# EAGLE schematic cft-int-board-smd (EAGLE 5.11)
DRAWN_BY: Alexios; PROJECT_NAME: CFT Mini-Computer; REVISION: Rev J; SHEET_DESCRIPTION: Bus Connectors; SIMULATION_FILENAME: N/A; URL: http://www.bedroomlan.org/cft

## Sheet 1 of 3
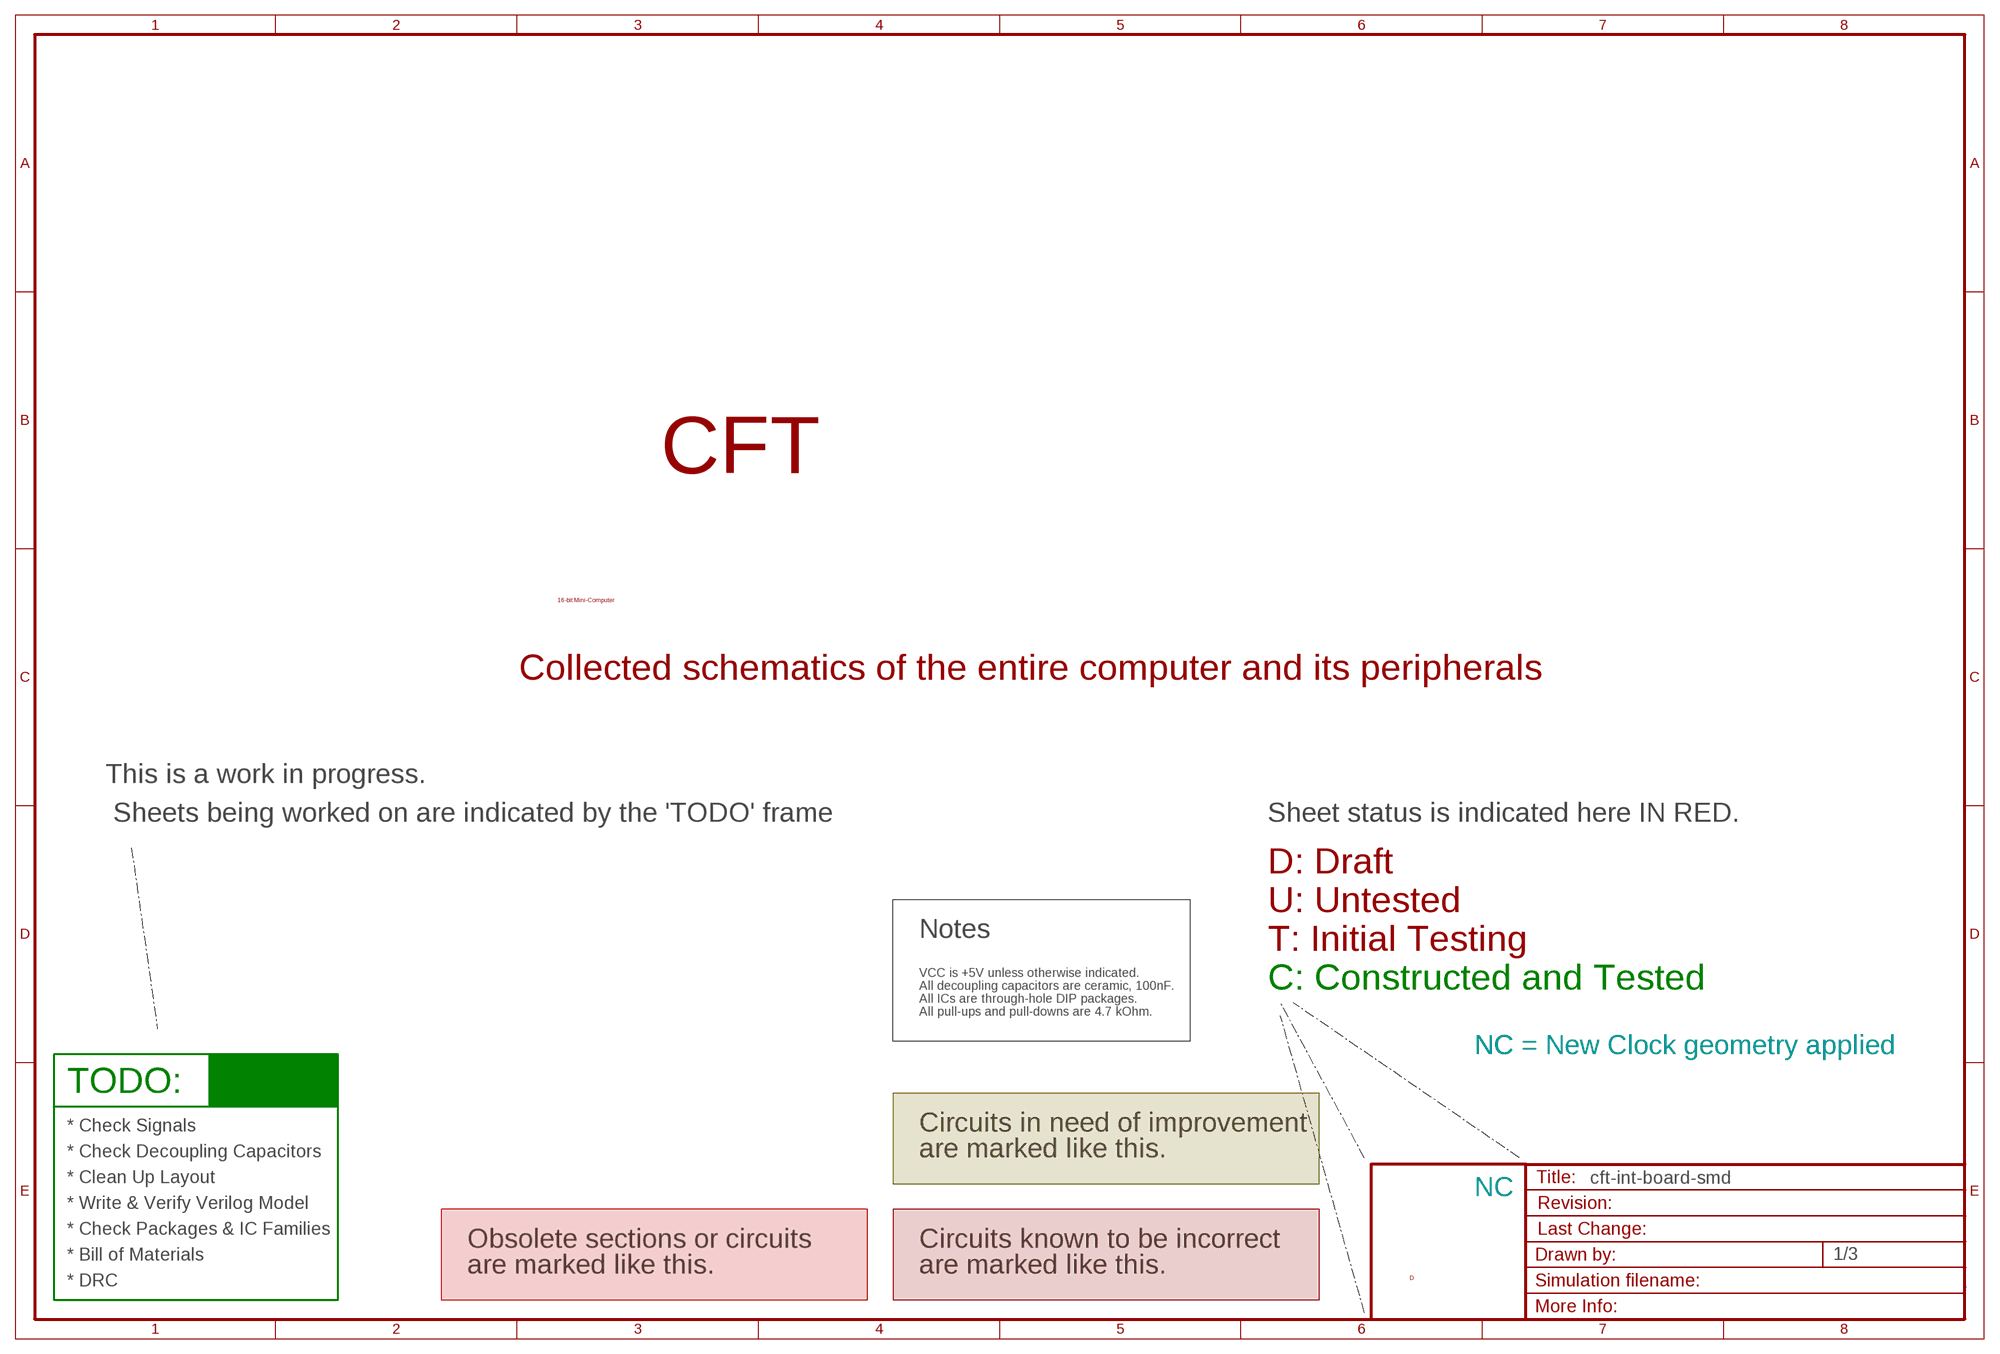
[diagram p0: schematic, sheet 1]

### Notes on the sheet
- CFT
- 16-bit Mini-Computer
- Collected schematics of the entire computer and its peripherals
- This is a work in progress.
- Sheets being worked on are indicated by the 'TODO' frame | Sheet status is indicated here IN RED.
- D: Draft
- U: Untested
- Notes
- T: Initial Testing
- VCC is +5V unless otherwise indicated.
- All decoupling capacitors are ceramic, 100nF. | C: Constructed and Tested
- All ICs are through-hole DIP packages.
- All pull-ups and pull-downs are 4.7 kOhm.
- NC | NC = New Clock geometry applied
- TODO:
- * Check Signals | Circuits in need of improvement
- * Check Decoupling Capacitors | are marked like this.
- * Clean Up Layout
- NC
- * Write & Verify Verilog Model
- * Check Packages & IC Families
- Obsolete sections or circuits | Circuits known to be incorrect
- * Bill of Materials
- are marked like this. | are marked like this.
- D
- * DRC

## Sheet 2 of 3
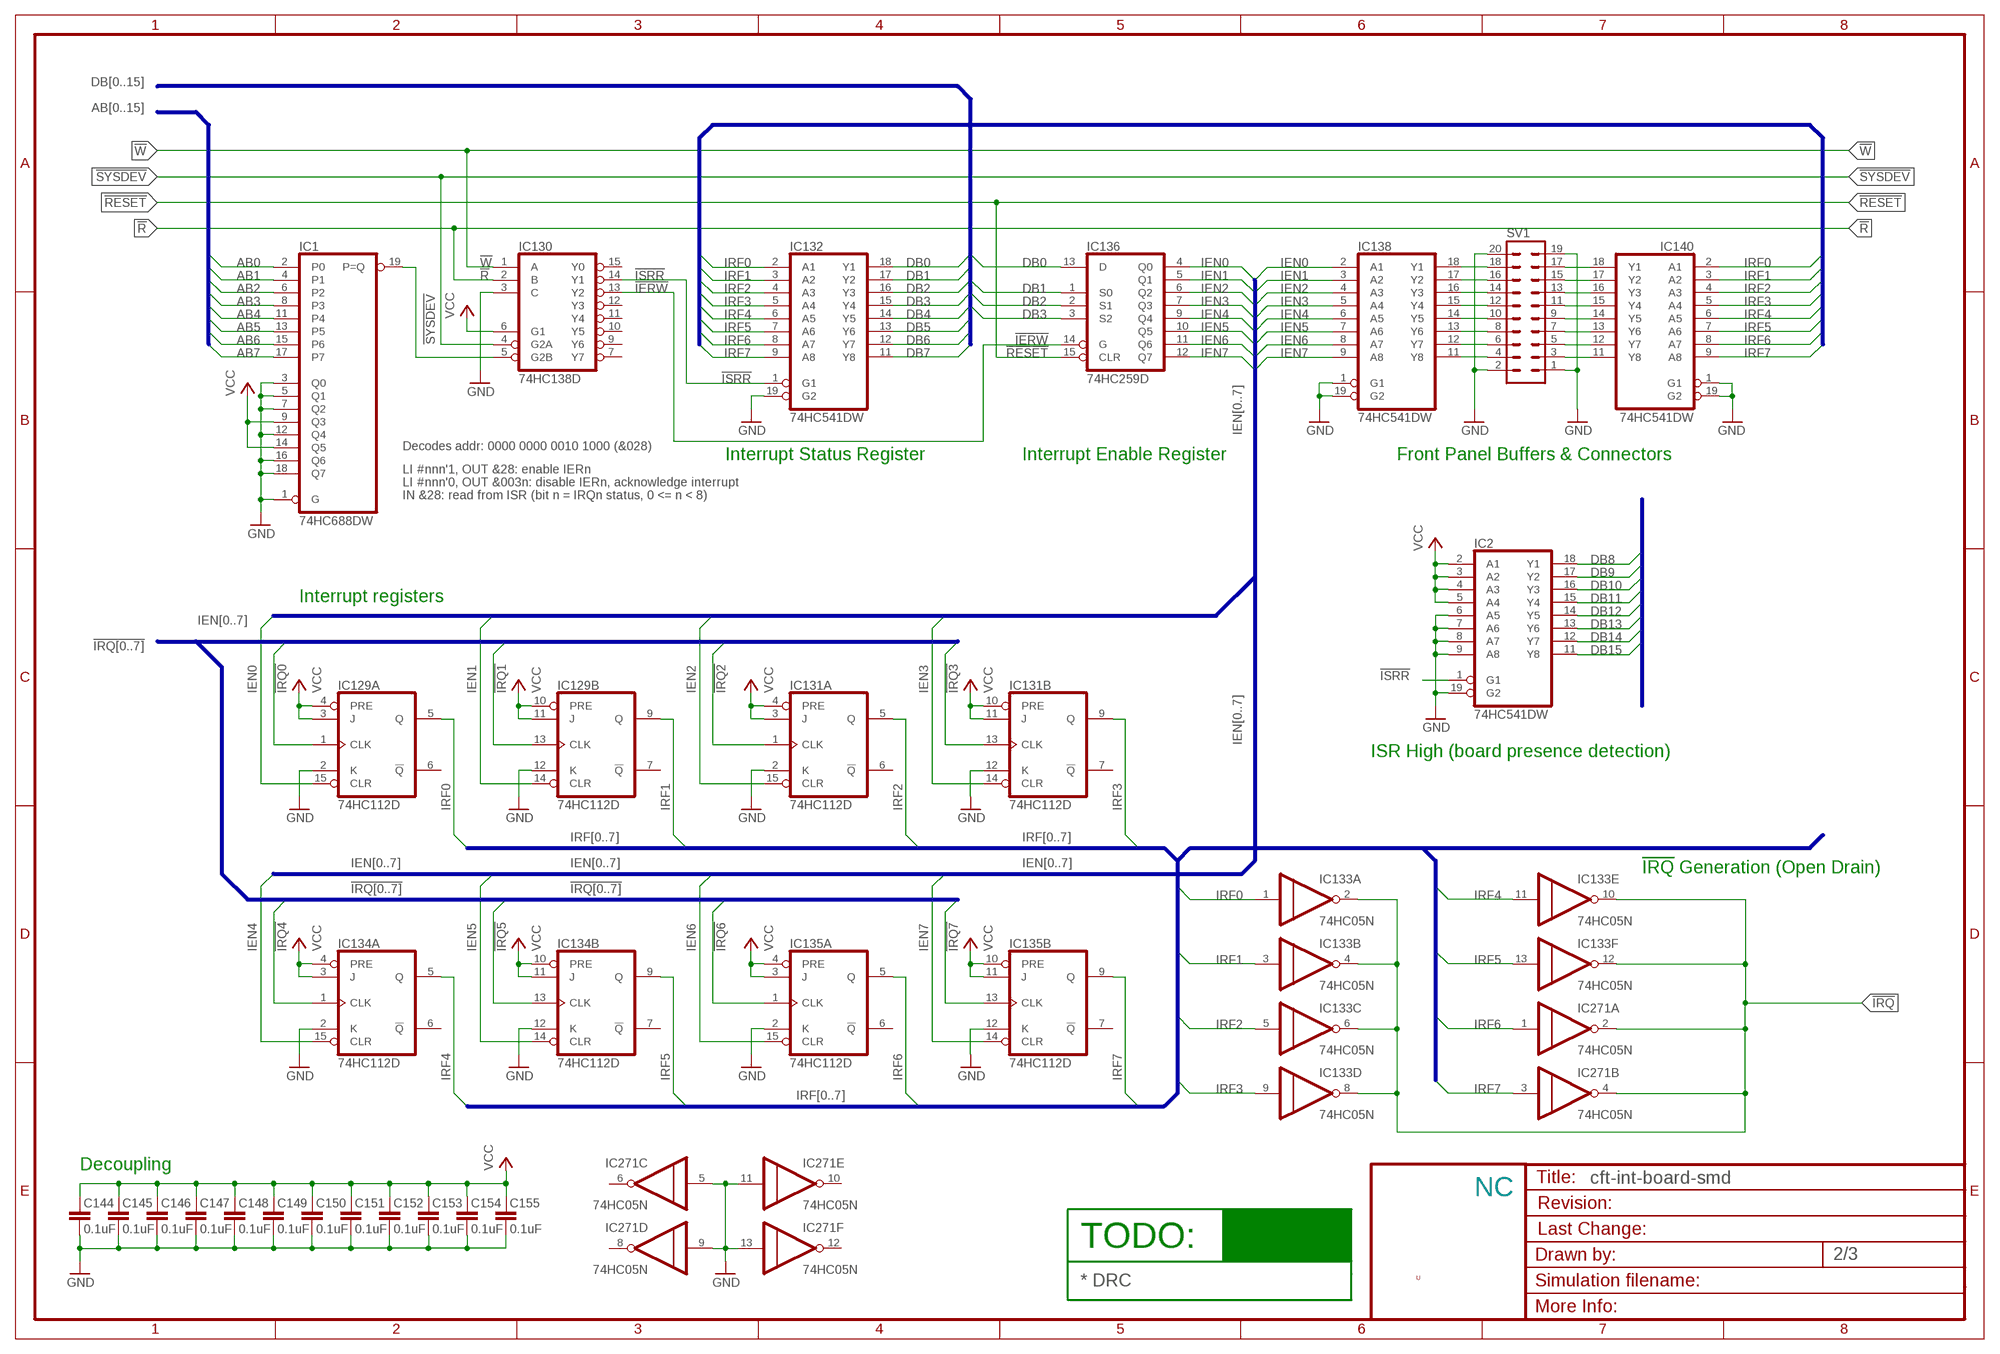
[diagram p1: schematic, sheet 2]

### Parts
C144  0.1uF  C-EU025-024X044  [C025-024X044]
C145  0.1uF  C-EU025-024X044  [C025-024X044]
C146  0.1uF  C-EU025-024X044  [C025-024X044]
C147  0.1uF  C-EU025-024X044  [C025-024X044]
C148  0.1uF  C-EU025-024X044  [C025-024X044]
C149  0.1uF  C-EU025-024X044  [C025-024X044]
C150  0.1uF  C-EU025-024X044  [C025-024X044]
C151  0.1uF  C-EU025-024X044  [C025-024X044]
C152  0.1uF  C-EU025-024X044  [C025-024X044]
C153  0.1uF  C-EU025-024X044  [C025-024X044]
C154  0.1uF  C-EU025-024X044  [C025-024X044]
C155  0.1uF  C-EU025-024X044  [C025-024X044]
IC1  74HC688DW  [SO20W]
IC2  74HC541DW  [SO20W]
IC129  74HC112D  [SO16]
IC130  74HC138D  [SO16]
IC131  74HC112D  [SO16]
IC132  74HC541DW  [SO20W]
IC133  74HC05N  [DIL14]
IC134  74HC112D  [SO16]
IC135  74HC112D  [SO16]
IC136  74HC259D  [SO16]
IC138  74HC541DW  [SO20W]
IC140  74HC541DW  [SO20W]
IC271  74HC05N  [DIL14]
SV1  ML20L  [ML20L]

### Nets
!IERW: IC130.13(Y2) IC136.14(G)
!IRQ: IC133.2(A:O) IC133.4(B:O) IC133.6(C:O) IC133.8(D:O) IC133.10(E:O) IC133.12(F:O) IC271.2(A:O) IC271.4(B:O) ; also sheet 3
!IRQ0: IC129.1(A:CLK) ; also sheet 3
!IRQ1: IC129.13(B:CLK) ; also sheet 3
!IRQ2: IC131.1(A:CLK) ; also sheet 3
!IRQ3: IC131.13(B:CLK) ; also sheet 3
!IRQ4: IC134.1(A:CLK) ; also sheet 3
!IRQ5: IC134.13(B:CLK) ; also sheet 3
!IRQ6: IC135.1(A:CLK) ; also sheet 3
!IRQ7: IC135.13(B:CLK) ; also sheet 3
!ISRR: IC130.14(Y1) IC132.1(G1)
!R: IC130.2(B) ; also sheet 3
!RESET: IC136.15(CLR) ; also sheet 3
!SYSDEV: IC130.4(G2A) ; also sheet 3
!W: IC130.1(A) ; also sheet 3
AB0: IC1.2(P0) ; also sheet 3
AB1: IC1.4(P1) ; also sheet 3
AB2: IC1.6(P2) ; also sheet 3
AB3: IC1.8(P3) ; also sheet 3
AB4: IC1.11(P4) ; also sheet 3
AB5: IC1.13(P5) ; also sheet 3
AB6: IC1.15(P6) ; also sheet 3
AB7: IC1.17(P7) ; also sheet 3
DB0: IC132.18(Y1) IC136.13(D) ; also sheet 3
DB1: IC132.17(Y2) IC136.1(S0) ; also sheet 3
DB2: IC132.16(Y3) IC136.2(S1) ; also sheet 3
DB3: IC132.15(Y4) IC136.3(S2) ; also sheet 3
DB4: IC132.14(Y5) ; also sheet 3
DB5: IC132.13(Y6) ; also sheet 3
DB6: IC132.12(Y7) ; also sheet 3
DB7: IC132.11(Y8) ; also sheet 3
DB8: IC2.18(Y1) ; also sheet 3
DB9: IC2.17(Y2) ; also sheet 3
DB10: IC2.16(Y3) ; also sheet 3
DB11: IC2.15(Y4) ; also sheet 3
DB12: IC2.14(Y5) ; also sheet 3
DB13: IC2.13(Y6) ; also sheet 3
DB14: IC2.12(Y7) ; also sheet 3
DB15: IC2.11(Y8) ; also sheet 3
GND [low power]: C144.1 C145.1 C146.1 C147.1 C148.1 C149.1 C150.1 C151.1 C152.1 C153.1 C154.1 C155.1 IC1.1(G) IC1.3(Q0) IC1.5(Q1) IC1.7(Q2) IC1.12(Q4) IC1.16(Q6) IC1.18(Q7) IC2.6(A5) IC2.7(A6) IC2.8(A7) IC2.9(A8) IC2.19(G2) IC129.2(A:K) IC129.12(B:K) IC130.3(C) IC131.2(A:K) IC131.12(B:K) IC132.19(G2) IC134.2(A:K) IC134.12(B:K) IC135.2(A:K) IC135.12(B:K) IC138.1(G1) IC138.19(G2) IC140.1(G1) IC140.19(G2) IC271.5(C:I) IC271.9(D:I) IC271.11(E:I) IC271.13(F:I) SV1.1 SV1.2 SV1.19 SV1.20 ; also sheet 3
IEN0: IC129.15(A:CLR) IC136.4(Q0) IC138.2(A1)
IEN1: IC129.14(B:CLR) IC136.5(Q1) IC138.3(A2)
IEN2: IC131.15(A:CLR) IC136.6(Q2) IC138.4(A3)
IEN3: IC131.14(B:CLR) IC136.7(Q3) IC138.5(A4)
IEN4: IC134.15(A:CLR) IC136.9(Q4) IC138.6(A5)
IEN5: IC134.14(B:CLR) IC136.10(Q5) IC138.7(A6)
IEN6: IC135.15(A:CLR) IC136.11(Q6) IC138.8(A7)
IEN7: IC135.14(B:CLR) IC136.12(Q7) IC138.9(A8)
IRF0: IC129.5(A:Q) IC132.2(A1) IC133.1(A:I) IC140.2(A1)
IRF1: IC129.9(B:Q) IC132.3(A2) IC133.3(B:I) IC140.3(A2)
IRF2: IC131.5(A:Q) IC132.4(A3) IC133.5(C:I) IC140.4(A3)
IRF3: IC131.9(B:Q) IC132.5(A4) IC133.9(D:I) IC140.5(A4)
IRF4: IC132.6(A5) IC133.11(E:I) IC134.5(A:Q) IC140.6(A5)
IRF5: IC132.7(A6) IC133.13(F:I) IC134.9(B:Q) IC140.7(A6)
IRF6: IC132.8(A7) IC135.5(A:Q) IC140.8(A7) IC271.1(A:I)
IRF7: IC132.9(A8) IC135.9(B:Q) IC140.9(A8) IC271.3(B:I)
N$1: IC138.18(Y1) SV1.18
N$2: IC138.17(Y2) SV1.16
N$3: IC138.16(Y3) SV1.14
N$4: IC138.15(Y4) SV1.12
N$5: IC138.14(Y5) SV1.10
N$6: IC138.13(Y6) SV1.8
N$7: IC138.12(Y7) SV1.6
N$8: IC138.11(Y8) SV1.4
N$9: IC140.18(Y1) SV1.17
N$10: IC140.17(Y2) SV1.15
N$11: IC140.16(Y3) SV1.13
N$12: IC140.15(Y4) SV1.11
N$13: IC140.14(Y5) SV1.9
N$14: IC140.13(Y6) SV1.7
N$15: IC140.12(Y7) SV1.5
N$16: IC140.11(Y8) SV1.3
N$17: IC1.19(P=Q) IC130.5(G2B)
VCC [low power]: C144.2 C145.2 C146.2 C147.2 C148.2 C149.2 C150.2 C151.2 C152.2 C153.2 C154.2 C155.2 IC1.9(Q3) IC1.14(Q5) IC2.2(A1) IC2.3(A2) IC2.4(A3) IC2.5(A4) IC129.3(A:J) IC129.4(A:PRE) IC129.10(B:PRE) IC129.11(B:J) IC130.6(G1) IC131.3(A:J) IC131.4(A:PRE) IC131.10(B:PRE) IC131.11(B:J) IC134.3(A:J) IC134.4(A:PRE) IC134.10(B:PRE) IC134.11(B:J) IC135.3(A:J) IC135.4(A:PRE) IC135.10(B:PRE) IC135.11(B:J) ; also sheet 3
Unconnected: IC2.1(G1) IC129.6(A:!Q) IC129.7(B:!Q) IC130.7(Y7) IC130.9(Y6) IC130.10(Y5) IC130.11(Y4) IC130.12(Y3) IC130.15(Y0) IC131.6(A:!Q) IC131.7(B:!Q) IC134.6(A:!Q) IC134.7(B:!Q) IC135.6(A:!Q) IC135.7(B:!Q) IC271.6(C:O) IC271.8(D:O) IC271.10(E:O) IC271.12(F:O)

### Buses
AB[0..15]
DB[0..15]
!IRQ[0..7]
IEN[0..7]
IRF[0..7]

### Notes on the sheet
- Decodes addr: 0000 0000 0010 1000 (&028)
- Interrupt Status Register | Interrupt Enable Register | Front Panel Buffers & Connectors
- LI #nnn'1, OUT &28: enable IERn
- LI #nnn'0, OUT &003n: disable IERn, acknowledge interrupt
- IN &28: read from ISR (bit n = IRQn status, 0 <= n < 8)
- Interrupt registers
- ISR High (board presence detection)
- !IRQ! Generation (Open Drain)
- Decoupling
- NC
- TODO:
- U
- * DRC

## Sheet 3 of 3
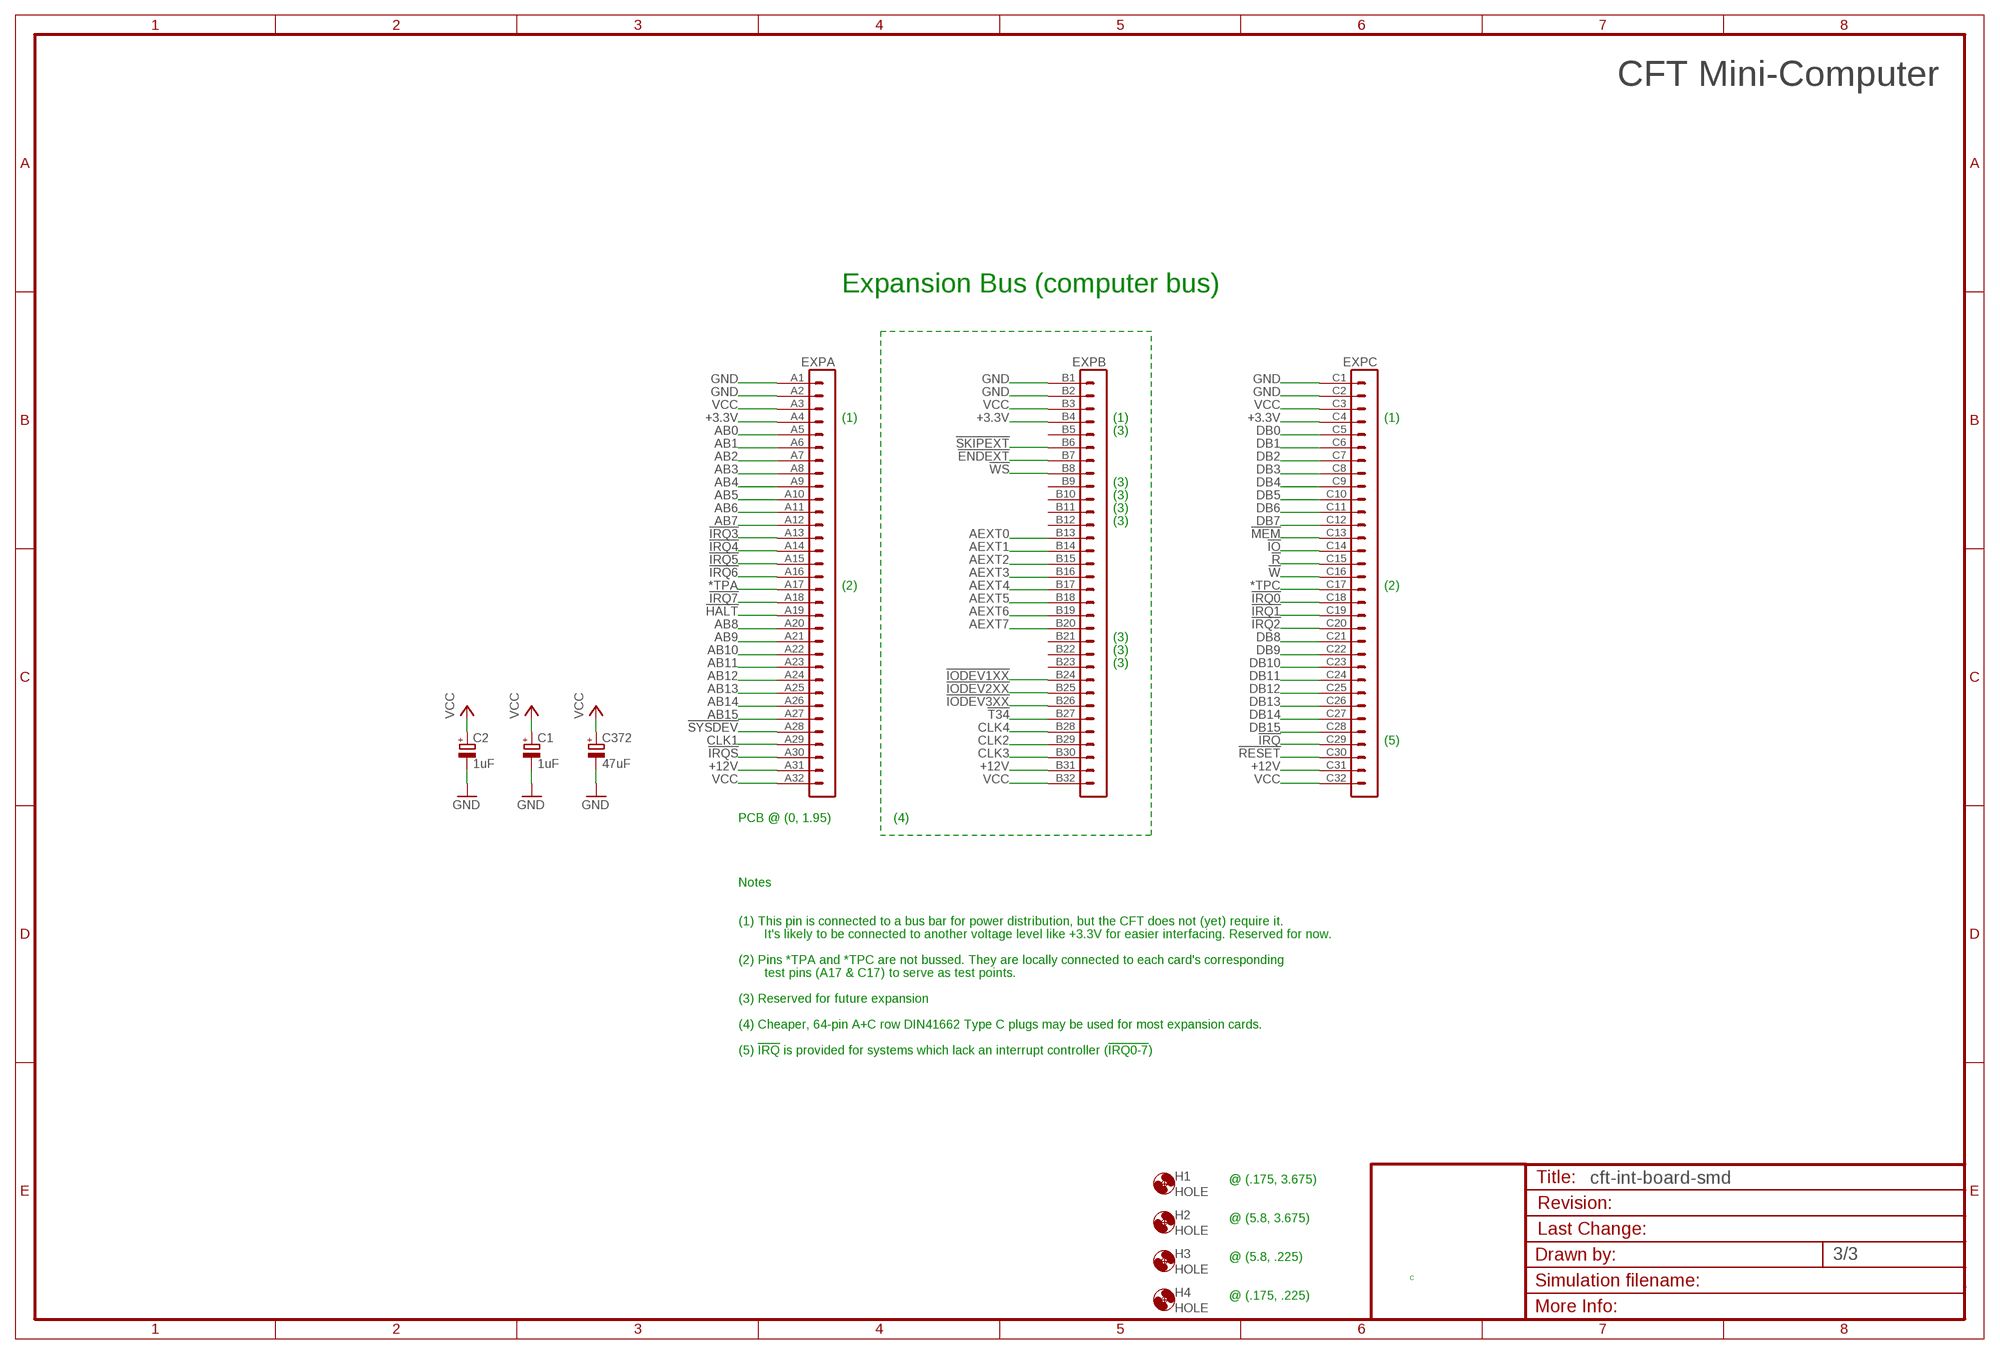
[diagram p2: schematic, sheet 3]

### Parts
C1  1uF  CPOL-EUE2.5-5  [E2,5-5]
C2  1uF  CPOL-EUE2.5-5  [E2,5-5]
C372  47uF  CPOL-EUE2.5-5  [E2,5-5]
EXP  VG96-3K  [VG96K]
H1  HOLE  [STANDOFF_28_60]
H2  HOLE  [STANDOFF_28_60]
H3  HOLE  [STANDOFF_28_60]
H4  HOLE  [STANDOFF_28_60]

### Nets
!ENDEXT: EXP.B7
!HALT: EXP.A19
!IO: EXP.C14
!IODEV1XX: EXP.B24
!IODEV2XX: EXP.B25
!IODEV3XX: EXP.B26
!IRQ: EXP.C29 ; also sheet 2
!IRQ0: EXP.C18 ; also sheet 2
!IRQ1: EXP.C19 ; also sheet 2
!IRQ2: EXP.C20 ; also sheet 2
!IRQ3: EXP.A13 ; also sheet 2
!IRQ4: EXP.A14 ; also sheet 2
!IRQ5: EXP.A15 ; also sheet 2
!IRQ6: EXP.A16 ; also sheet 2
!IRQ7: EXP.A18 ; also sheet 2
!IRQS: EXP.A30
!MEM: EXP.C13
!R: EXP.C15 ; also sheet 2
!RESET: EXP.C30 ; also sheet 2
!SKIPEXT: EXP.B6
!SYSDEV: EXP.A28 ; also sheet 2
!T34: EXP.B27
!W: EXP.C16 ; also sheet 2
!WS: EXP.B8
*TPA: EXP.A17
*TPC: EXP.C17
+3.3V: EXP.A4 EXP.B4 EXP.C4
+12V [LED power]: EXP.A31 EXP.B31 EXP.C31
AB0: EXP.A5 ; also sheet 2
AB1: EXP.A6 ; also sheet 2
AB2: EXP.A7 ; also sheet 2
AB3: EXP.A8 ; also sheet 2
AB4: EXP.A9 ; also sheet 2
AB5: EXP.A10 ; also sheet 2
AB6: EXP.A11 ; also sheet 2
AB7: EXP.A12 ; also sheet 2
AB8: EXP.A20
AB9: EXP.A21
AB10: EXP.A22
AB11: EXP.A23
AB12: EXP.A24
AB13: EXP.A25
AB14: EXP.A26
AB15: EXP.A27
AEXT0: EXP.B13
AEXT1: EXP.B14
AEXT2: EXP.B15
AEXT3: EXP.B16
AEXT4: EXP.B17
AEXT5: EXP.B18
AEXT6: EXP.B19
AEXT7: EXP.B20
CLK1: EXP.A29
CLK2: EXP.B29
CLK3: EXP.B30
CLK4: EXP.B28
DB0: EXP.C5 ; also sheet 2
DB1: EXP.C6 ; also sheet 2
DB2: EXP.C7 ; also sheet 2
DB3: EXP.C8 ; also sheet 2
DB4: EXP.C9 ; also sheet 2
DB5: EXP.C10 ; also sheet 2
DB6: EXP.C11 ; also sheet 2
DB7: EXP.C12 ; also sheet 2
DB8: EXP.C21 ; also sheet 2
DB9: EXP.C22 ; also sheet 2
DB10: EXP.C23 ; also sheet 2
DB11: EXP.C24 ; also sheet 2
DB12: EXP.C25 ; also sheet 2
DB13: EXP.C26 ; also sheet 2
DB14: EXP.C27 ; also sheet 2
DB15: EXP.C28 ; also sheet 2
GND [low power]: C1.- C2.- C372.- EXP.A1 EXP.A2 EXP.B1 EXP.B2 EXP.C1 EXP.C2 ; also sheet 2
VCC [low power]: C1.+ C2.+ C372.+ EXP.A3 EXP.A32 EXP.B3 EXP.B32 EXP.C3 EXP.C32 ; also sheet 2
Unconnected: EXP.B5 EXP.B9 EXP.B10 EXP.B11 EXP.B12 EXP.B21 EXP.B22 EXP.B23

### Notes on the sheet
- CFT Mini-Computer
- Expansion Bus (computer bus)
- (1) | (1) | (1)
- (3)
- (3)
- (3)
- (3)
- (3)
- (2) | (2)
- (3)
- (3)
- (3)
- (5)
- PCB @ (0, 1.95) | (4)
- Notes
- (1) This pin is connected to a bus bar for power distribution, but the CFT does not (yet) require it.
- It's likely to be connected to another voltage level like +3.3V for easier interfacing. Reserved for now.
- (2) Pins *TPA and *TPC are not bussed. They are locally connected to each card's corresponding
- test pins (A17 & C17) to serve as test points.
- (3) Reserved for future expansion
- (4) Cheaper, 64-pin A+C row DIN41662 Type C plugs may be used for most expansion cards.
- (5) !IRQ! is provided for systems which lack an interrupt controller (!IRQ0-7!)
- @ (.175, 3.675)
- @ (5.8, 3.675)
- @ (5.8, .225)
- C
- @ (.175, .225)

## Power pins joined to a net without a drawn wire
GND: IC1.10(GND) IC2.10(GND) IC129.8(P:GND) IC130.8(GND) IC131.8(P:GND) IC132.10(GND) IC133.7(P:GND) IC134.8(P:GND) IC135.8(P:GND) IC136.8(GND) IC138.10(GND) IC140.10(GND) IC271.7(P:GND)
VCC: IC1.20(VCC) IC2.20(VCC) IC129.16(P:VCC) IC130.16(VCC) IC131.16(P:VCC) IC132.20(VCC) IC133.14(P:VCC) IC134.16(P:VCC) IC135.16(P:VCC) IC136.16(VCC) IC138.20(VCC) IC140.20(VCC) IC271.14(P:VCC)

## Library data of the parts
C1 C2 C372 = rcl:CPOL-EU: POLARIZED CAPACITOR, European symbol
C144-C155 = rcl:C-EU: CAPACITOR, European symbol
EXP = alexios-19inch:VG96-3: PCB EUROCARD, 96-pin type C/ABC, 2.54 mm
H1-H4 = alexios:HOLE: Hole for a standoff or mount. Hole diameter: 3.3mm. External Diameter: 6mm.
IC1 = alexios:74*688: 8-bit MAGNITUDE/IDENTITY COMPARATOR, totem pole
IC2 IC132 IC138 IC140 = alexios:74*541: Octal BUFFER and LINE DRIVER, 3-state
IC129 IC131 IC134 IC135 = alexios:74*112: Dual J-K negative edge triggered FLIP FLOP, preset and clear
IC130 = alexios:74*138: 3-line to 8-line DECODER/DEMULTIPLEXER
IC133 IC271 = alexios:74*05: Hex INVERTER, open collector/drain
IC136 = alexios:74*259: 8-bit addressable LATCH
SV1 = con-harting-ml:ML20: HARTING; OC_FARNELL: unknown; OC_NEWARK: unknown

## Net classes
0 default: width 0.305 mm, clearance 0.203 mm
1 low power: width 1.27 mm, clearance 0.254 mm
2 LED power: width 1.93 mm, clearance 0.254 mm